# Altium schematic sheet Sheet1.SchDoc
size A4
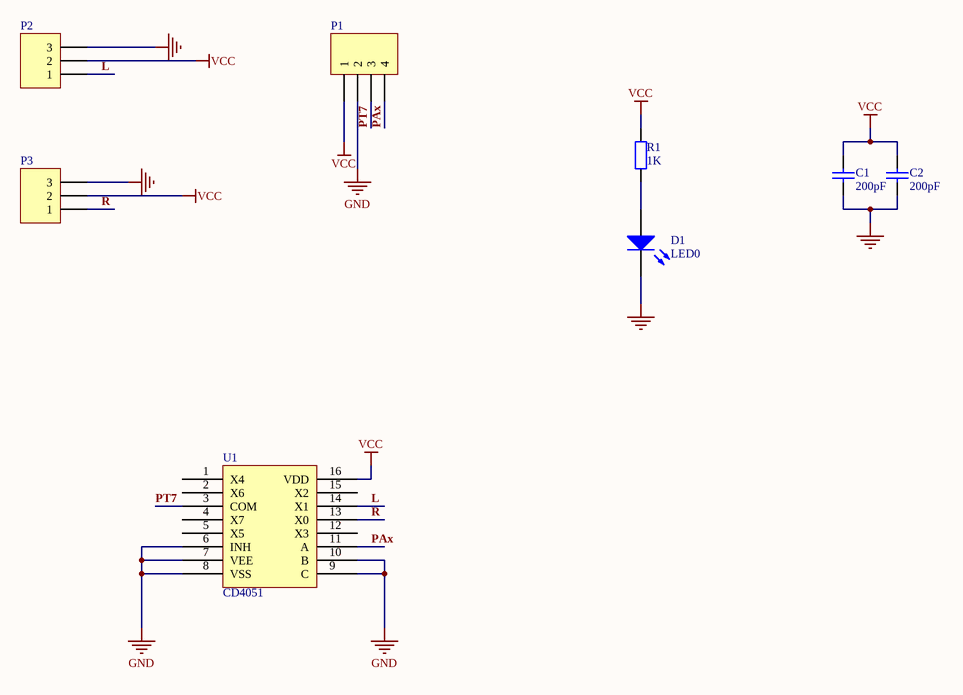
[diagram p0: Sheet1.SchDoc]

## Parts
C1  value 200pF  [C0805]  (hidden comment: Cap)
C2  value 200pF  [C0805]  (hidden comment: Cap)
D1  LED0  [C0805]
P1  Header 4  [HDR1X4]  (value not drawn)
P2  Header 3  [HDR1X3]  (value not drawn)
P3  Header 3  [HDR1X3]  (value not drawn)
R1  value 1K  [C0805]  (hidden comment: Res2)
U1  CD4051  [DIP-16]

## Nets
GND: C1.1 C2.1 D1.2(K) P1.2 P2.3 P3.3 U1.6(INH) U1.7(VEE) U1.8(VSS) U1.9(C) U1.10(B)
VCC: C1.2 C2.2 P1.1 P2.2 P3.2 R1.2 U1.16(VDD)
L: P2.1 U1.14(X1)
PAx: P1.4 U1.11(A)
PT7: P1.3 U1.3(COM)
R: P3.1 U1.13(X0)
NetD1_1: D1.1(A) R1.1

Not connected (* = marked no-connect by the designer): U1 1(X4) 2(X6) 4(X7) 5(X5) 12(X3) 15(X2)

## Library data of the parts
C1 C2 = Cap: Capacitor; Published: 8-Jun-2000; LatestRevisionDate: 17-Jul-2002; LatestRevisionNote: Re-released for DXP Platform.; PackageReference: RAD-0.3; Publisher: Altium Limited
D1 = LED0: Typical INFRARED GaAs LED; Published: 8-Jun-2000; LatestRevisionDate: 08-Jul-2005; LatestRevisionNote: Mech Layer 1 removed.; PackageReference: LED-0; Publisher: Altium Limited
P1 = Header 4: Header, 4-Pin; LatestRevisionDate: 17-Jul-2002; LatestRevisionNote: Re-released for DXP Platform.; Publisher: Altium Limited
P2 P3 = Header 3: Header, 3-Pin; LatestRevisionDate: 17-Jul-2002; LatestRevisionNote: Re-released for DXP Platform.; Publisher: Altium Limited
R1 = Res2: Resistor; Published: 8-Jun-2000; LatestRevisionDate: 17-Jul-2002; LatestRevisionNote: Re-released for DXP Platform.; PackageReference: AXIAL-0.4; Publisher: Altium Limited
U1 = Component_1